# Altium schematic sheet Deneigus_Sensors.SchDoc
size Tabloid; Sheet_Name: Sensors; Size: 11x17
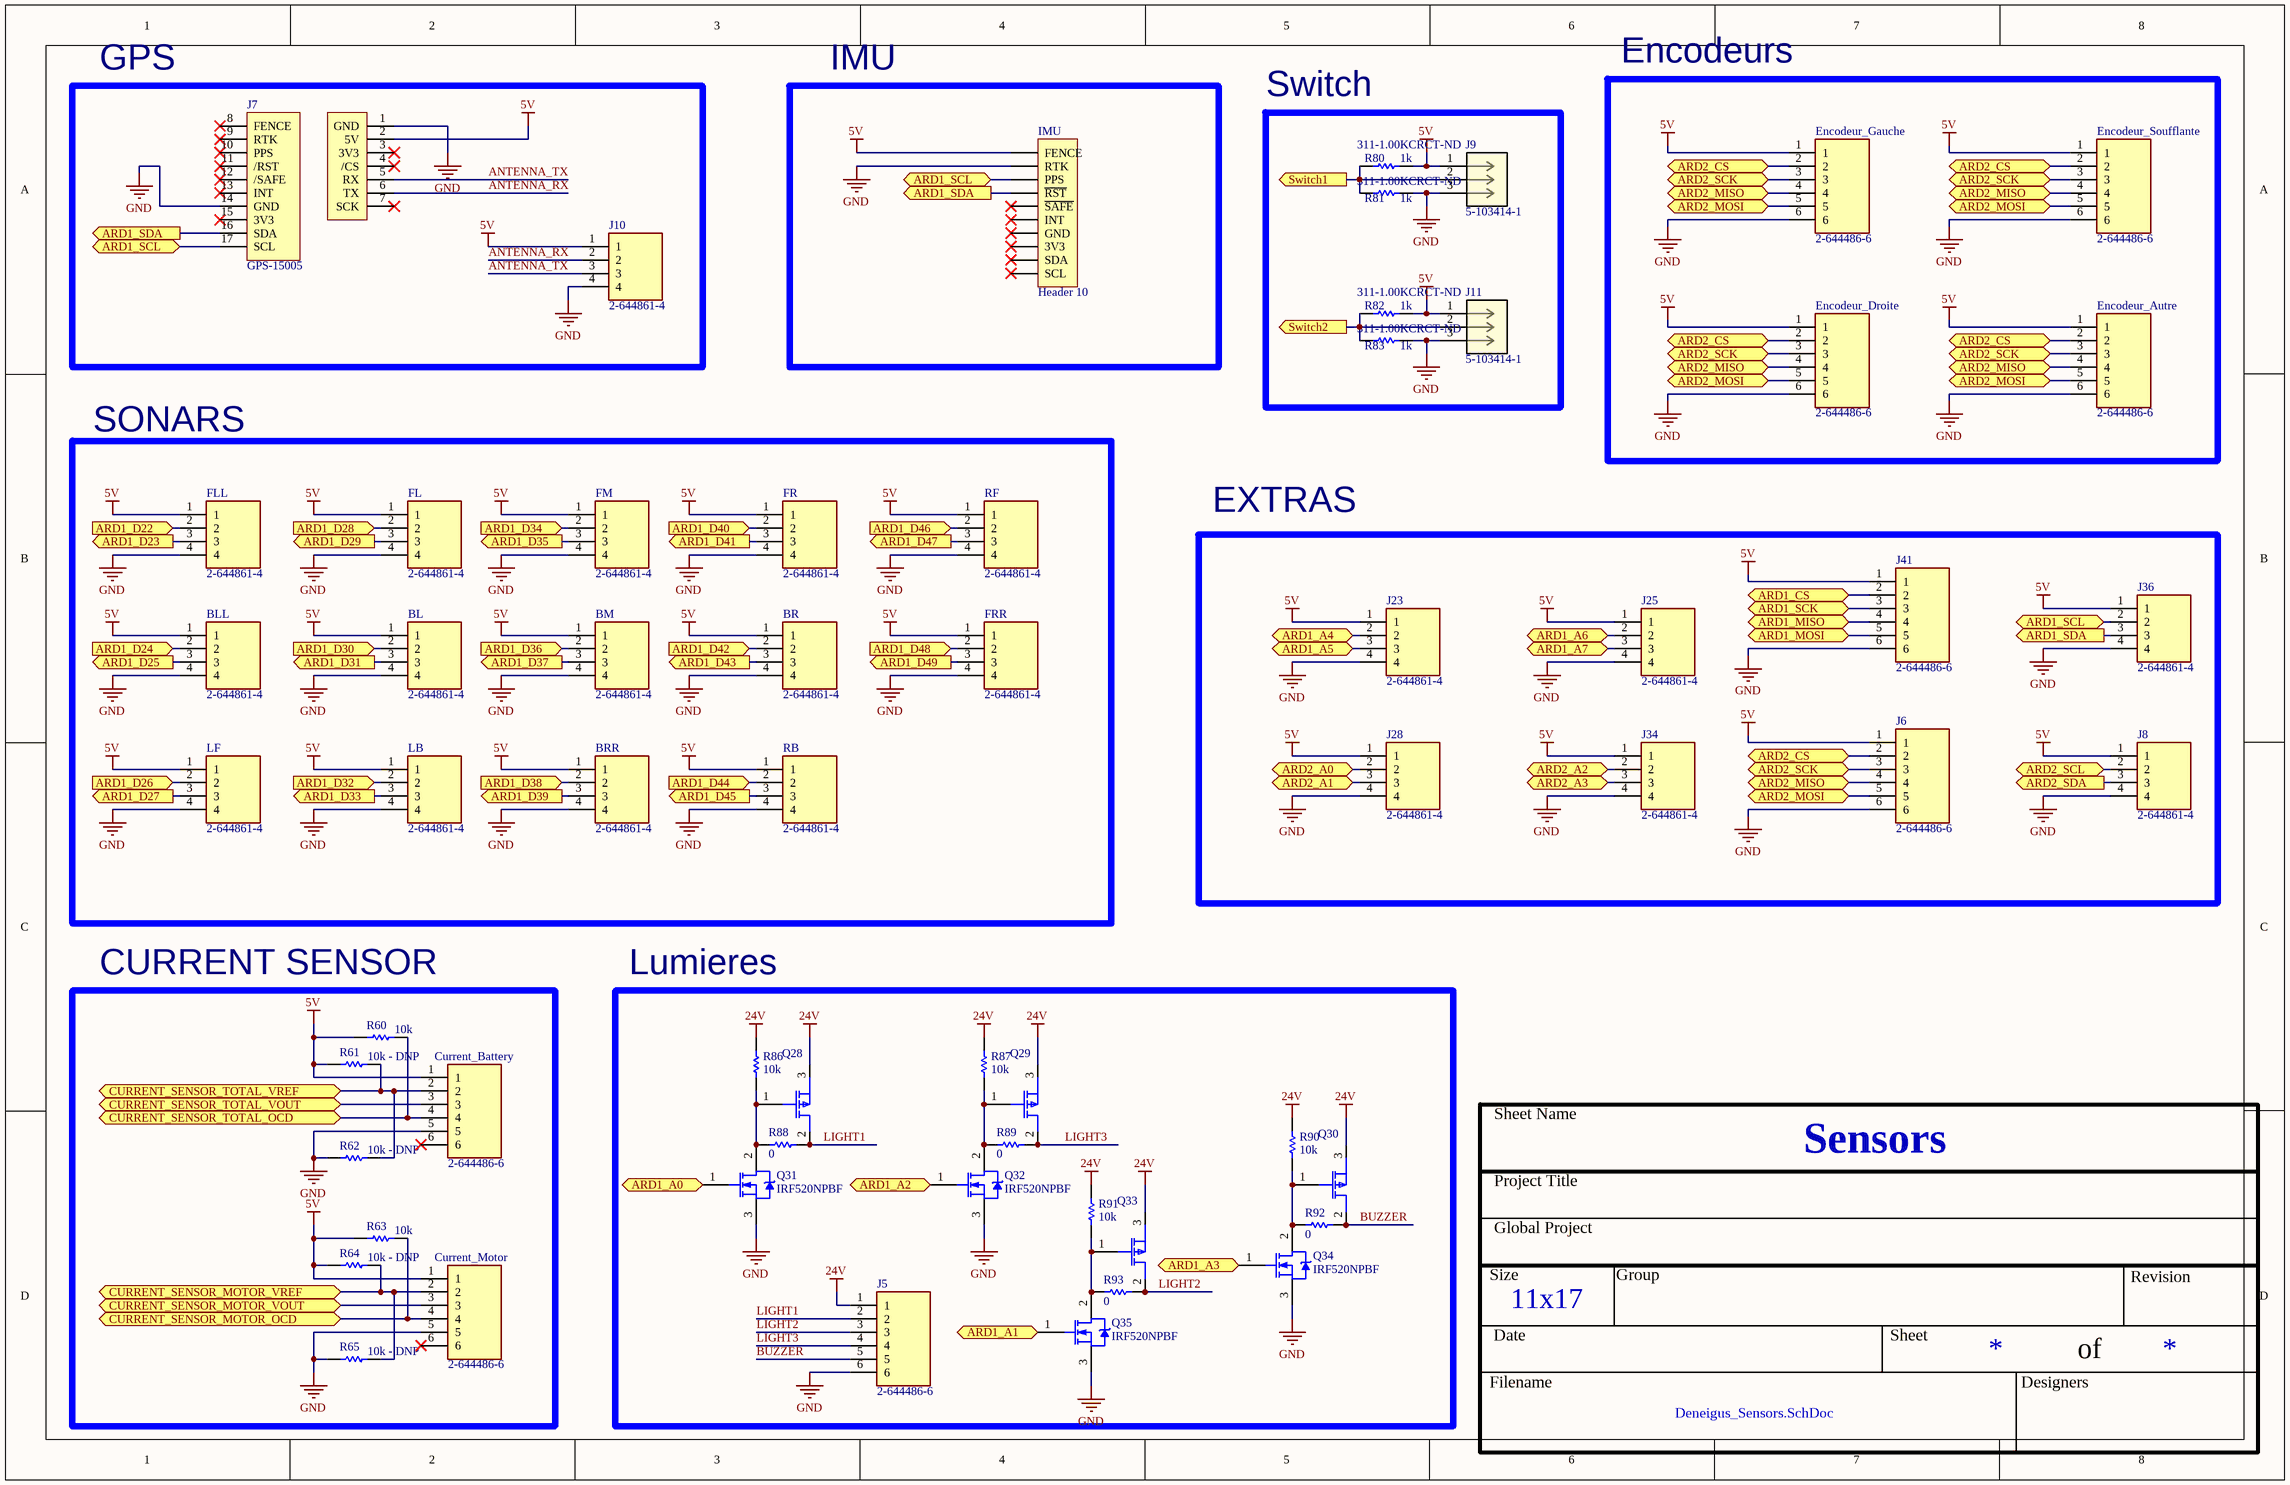
[diagram p0: Deneigus_Sensors.SchDoc]

## Parts
BL  2-644861-4  [TE_2-644861-4]
BLL  2-644861-4  [TE_2-644861-4]
BM  2-644861-4  [TE_2-644861-4]
BR  2-644861-4  [TE_2-644861-4]
BRR  2-644861-4  [TE_2-644861-4]
Current_Battery  2-644486-6  [TE_2-644486-6]
Current_Motor  2-644486-6  [TE_2-644486-6]
Encodeur_Autre  2-644486-6  [TE_2-644486-6]
Encodeur_Droite  2-644486-6  [TE_2-644486-6]
Encodeur_Gauche  2-644486-6  [TE_2-644486-6]
Encodeur_Soufflante  2-644486-6  [TE_2-644486-6]
FL  2-644861-4  [TE_2-644861-4]
FLL  2-644861-4  [TE_2-644861-4]
FM  2-644861-4  [TE_2-644861-4]
FR  2-644861-4  [TE_2-644861-4]
FRR  2-644861-4  [TE_2-644861-4]
IMU  Header 10  [HDR1X10]
J5  2-644486-6  [TE_2-644486-6]
J6  2-644486-6  [TE_2-644486-6]
J7  GPS-15005  [GPS_PFB]
J8  2-644861-4  [TE_2-644861-4]
J9  5-103414-1  [CONN_5-103414-1_TYCO]
J10  2-644861-4  [TE_2-644861-4]
J11  5-103414-1  [CONN_5-103414-1_TYCO]
J23  2-644861-4  [TE_2-644861-4]
J25  2-644861-4  [TE_2-644861-4]
J28  2-644861-4  [TE_2-644861-4]
J34  2-644861-4  [TE_2-644861-4]
J36  2-644861-4  [TE_2-644861-4]
J41  2-644486-6  [TE_2-644486-6]
LB  2-644861-4  [TE_2-644861-4]
LF  2-644861-4  [TE_2-644861-4]
Q28  MOSFET P-CH 55V 12A TO220AB  [IRF9Z24NPBF]  (value not drawn)
Q29  MOSFET P-CH 55V 12A TO220AB  [IRF9Z24NPBF]  (value not drawn)
Q30  MOSFET P-CH 55V 12A TO220AB  [IRF9Z24NPBF]  (value not drawn)
Q31  IRF520NPBF  [INTR-TO-220AB-3]
Q32  IRF520NPBF  [INTR-TO-220AB-3]
Q33  MOSFET P-CH 55V 12A TO220AB  [IRF9Z24NPBF]  (value not drawn)
Q34  IRF520NPBF  [INTR-TO-220AB-3]
Q35  IRF520NPBF  [INTR-TO-220AB-3]
R60  value 10k  [RES_0805]  (hidden comment: Res1)
R61  value 10k - DNP  [RES_0805]  (hidden comment: Res1)
R62  value 10k - DNP  [RES_0805]  (hidden comment: Res1)
R63  value 10k  [RES_0805]  (hidden comment: Res1)
R64  value 10k - DNP  [RES_0805]  (hidden comment: Res1)
R65  value 10k - DNP  [RES_0805]  (hidden comment: Res1)
R80  value 1k  Supplier Part Number 1: 311-1.00KCRCT-ND  [RES_0805]  (hidden comment: RES - 0805)
R81  value 1k  Supplier Part Number 1: 311-1.00KCRCT-ND  [RES_0805]  (hidden comment: RES - 0805)
R82  value 1k  Supplier Part Number 1: 311-1.00KCRCT-ND  [RES_0805]  (hidden comment: RES - 0805)
R83  value 1k  Supplier Part Number 1: 311-1.00KCRCT-ND  [RES_0805]  (hidden comment: RES - 0805)
R86  value 10k  [RES_0805]  (hidden comment: Res1)
R87  value 10k  [RES_0805]  (hidden comment: Res1)
R88  value 0  [RES_0805]  (hidden comment: Res1)
R89  value 0  [RES_0805]  (hidden comment: Res1)
R90  value 10k  [RES_0805]  (hidden comment: Res1)
R91  value 10k  [RES_0805]  (hidden comment: Res1)
R92  value 0  [RES_0805]  (hidden comment: Res1)
R93  value 0  [RES_0805]  (hidden comment: Res1)
RB  2-644861-4  [TE_2-644861-4]
RF  2-644861-4  [TE_2-644861-4]

## Blocks framed on the sheet
GPS: J7 J10
IMU: IMU
Switch: J9 J11 R80-R83
Encodeurs: Encodeur_Autre Encodeur_Droite Encodeur_Gauche Encodeur_Soufflante
SONARS: BL BLL BM BR BRR FL FLL FM FR FRR LB LF RB RF
EXTRAS: J6 J8 J23 J25 J28 J34 J36 J41
CURRENT SENSOR: Current_Battery Current_Motor R60-R65
Lumieres: J5 Q28-Q35 R86-R93

## Ports
ARD1_A0 (bidir), ARD1_A1 (bidir), ARD1_A2 (bidir), ARD1_A3 (bidir), ARD1_A4 (bidir), ARD1_A5 (bidir), ARD1_A6 (bidir), ARD1_A7 (bidir), ARD1_CS (bidir), ARD1_D22 (in), ARD1_D23 (out), ARD1_D24 (in), ARD1_D25 (out), ARD1_D26 (in), ARD1_D27 (out), ARD1_D28 (in), ARD1_D29 (out), ARD1_D30 (in), ARD1_D31 (out), ARD1_D32 (in), ARD1_D33 (out), ARD1_D34 (in), ARD1_D35 (out), ARD1_D36 (in), ARD1_D37 (out), ARD1_D38 (in), ARD1_D39 (out), ARD1_D40 (in), ARD1_D41 (out), ARD1_D42 (in), ARD1_D43 (out), ARD1_D44 (in), ARD1_D45 (out), ARD1_D46 (in), ARD1_D47 (out), ARD1_D48 (in), ARD1_D49 (out), ARD1_MISO (bidir), ARD1_MOSI (bidir), ARD1_SCK (bidir), ARD1_SCL (bidir), ARD1_SDA (out), ARD2_A0 (bidir), ARD2_A1 (bidir), ARD2_A2 (bidir), ARD2_A3 (bidir), ARD2_CS (bidir), ARD2_MISO (bidir), ARD2_MOSI (bidir), ARD2_SCK (bidir), ARD2_SCL (bidir), ARD2_SDA (out), CURRENT_SENSOR_MOTOR_OCD (bidir), CURRENT_SENSOR_MOTOR_VOUT (bidir), CURRENT_SENSOR_MOTOR_VREF (bidir), CURRENT_SENSOR_TOTAL_OCD (bidir), CURRENT_SENSOR_TOTAL_VOUT (bidir), CURRENT_SENSOR_TOTAL_VREF (bidir), Switch1 (out), Switch2 (out)

## Nets
5V: BL.1 BLL.1 BM.1 BR.1 BRR.1 Current_Battery.1 Current_Motor.1 Encodeur_Autre.1 Encodeur_Droite.1 Encodeur_Gauche.1 Encodeur_Soufflante.1 FL.1 FLL.1 FM.1 FR.1 FRR.1 IMU.1(FENCE) J6.1 J7.2(5V) J8.1 J9.1 J10.1 J11.1 J23.1 J25.1 J28.1 J34.1 J36.1 J41.1 LB.1 LF.1 R60.2 R61.2 R63.2 R64.2 R80.2 R82.2 RB.1 RF.1
24V: J5.1 Q28.3(Source) Q29.3(Source) Q30.3(Source) Q33.3(Source) R86.1 R87.1 R90.1 R91.1
GND: BL.4 BLL.4 BM.4 BR.4 BRR.4 Current_Battery.5 Current_Motor.5 Encodeur_Autre.6 Encodeur_Droite.6 Encodeur_Gauche.6 Encodeur_Soufflante.6 FL.4 FLL.4 FM.4 FR.4 FRR.4 IMU.2(RTK) J5.6 J6.6 J7.1(GND) J7.14(GND) J8.4 J9.3 J10.4 J11.3 J23.4 J25.4 J28.4 J34.4 J36.4 J41.6 LB.4 LF.4 Q31.3(S) Q32.3(S) Q34.3(S) Q35.3(S) R62.2 R65.2 R81.1 R83.1 RB.4 RF.4
ANTENNA_RX: J7.6(TX) J10.2
ANTENNA_TX: J7.5(RX) J10.3
ARD1_A0: Q31.1(G) ; port ARD1_A0
ARD1_A1: Q35.1(G) ; port ARD1_A1
ARD1_A2: Q32.1(G) ; port ARD1_A2
ARD1_A3: Q34.1(G) ; port ARD1_A3
ARD1_A4: J23.2 ; port ARD1_A4
ARD1_A5: J23.3 ; port ARD1_A5
ARD1_A6: J25.2 ; port ARD1_A6
ARD1_A7: J25.3 ; port ARD1_A7
ARD1_CS: J41.2 ; port ARD1_CS
ARD1_D22: FLL.2 ; port ARD1_D22
ARD1_D23: FLL.3 ; port ARD1_D23
ARD1_D24: BLL.2 ; port ARD1_D24
ARD1_D25: BLL.3 ; port ARD1_D25
ARD1_D26: LF.2 ; port ARD1_D26
ARD1_D27: LF.3 ; port ARD1_D27
ARD1_D28: FL.2 ; port ARD1_D28
ARD1_D29: FL.3 ; port ARD1_D29
ARD1_D30: BL.2 ; port ARD1_D30
ARD1_D31: BL.3 ; port ARD1_D31
ARD1_D32: LB.2 ; port ARD1_D32
ARD1_D33: LB.3 ; port ARD1_D33
ARD1_D34: FM.2 ; port ARD1_D34
ARD1_D35: FM.3 ; port ARD1_D35
ARD1_D36: BM.2 ; port ARD1_D36
ARD1_D37: BM.3 ; port ARD1_D37
ARD1_D38: BRR.2 ; port ARD1_D38
ARD1_D39: BRR.3 ; port ARD1_D39
ARD1_D40: FR.2 ; port ARD1_D40
ARD1_D41: FR.3 ; port ARD1_D41
ARD1_D42: BR.2 ; port ARD1_D42
ARD1_D43: BR.3 ; port ARD1_D43
ARD1_D44: RB.2 ; port ARD1_D44
ARD1_D45: RB.3 ; port ARD1_D45
ARD1_D46: RF.2 ; port ARD1_D46
ARD1_D47: RF.3 ; port ARD1_D47
ARD1_D48: FRR.2 ; port ARD1_D48
ARD1_D49: FRR.3 ; port ARD1_D49
ARD1_MISO: J41.4 ; port ARD1_MISO
ARD1_MOSI: J41.5 ; port ARD1_MOSI
ARD1_SCK: J41.3 ; port ARD1_SCK
ARD1_SCL: IMU.3(PPS) J7.17(SCL) J36.2 ; port ARD1_SCL
ARD1_SDA: IMU.4(~{RST}) J7.16(SDA) J36.3 ; port ARD1_SDA
ARD2_A0: J28.2 ; port ARD2_A0
ARD2_A1: J28.3 ; port ARD2_A1
ARD2_A2: J34.2 ; port ARD2_A2
ARD2_A3: J34.3 ; port ARD2_A3
ARD2_CS: Encodeur_Autre.2 Encodeur_Droite.2 Encodeur_Gauche.2 Encodeur_Soufflante.2 J6.2 ; port ARD2_CS
ARD2_MISO: Encodeur_Autre.4 Encodeur_Droite.4 Encodeur_Gauche.4 Encodeur_Soufflante.4 J6.4 ; port ARD2_MISO
ARD2_MOSI: Encodeur_Autre.5 Encodeur_Droite.5 Encodeur_Gauche.5 Encodeur_Soufflante.5 J6.5 ; port ARD2_MOSI
ARD2_SCK: Encodeur_Autre.3 Encodeur_Droite.3 Encodeur_Gauche.3 Encodeur_Soufflante.3 J6.3 ; port ARD2_SCK
ARD2_SCL: J8.2 ; port ARD2_SCL
ARD2_SDA: J8.3 ; port ARD2_SDA
BUZZER: J5.5 Q30.2(Drain) R92.2
CURRENT_SENSOR_MOTOR_OCD: Current_Motor.4 R63.1 ; port CURRENT_SENSOR_MOTOR_OCD
CURRENT_SENSOR_MOTOR_VOUT: Current_Motor.3 ; port CURRENT_SENSOR_MOTOR_VOUT
CURRENT_SENSOR_MOTOR_VREF: Current_Motor.2 R64.1 R65.1 ; port CURRENT_SENSOR_MOTOR_VREF
CURRENT_SENSOR_TOTAL_OCD: Current_Battery.4 R60.1 ; port CURRENT_SENSOR_TOTAL_OCD
CURRENT_SENSOR_TOTAL_VOUT: Current_Battery.3 ; port CURRENT_SENSOR_TOTAL_VOUT
CURRENT_SENSOR_TOTAL_VREF: Current_Battery.2 R61.1 R62.1 ; port CURRENT_SENSOR_TOTAL_VREF
LIGHT1: J5.2 Q28.2(Drain) R88.2
LIGHT2: J5.3 Q33.2(Drain) R93.2
LIGHT3: J5.4 Q29.2(Drain) R89.2
Switch1: J9.2 R80.1 R81.2 ; port Switch1
Switch2: J11.2 R82.1 R83.2 ; port Switch2
NetQ28_1: Q28.1(Gate) Q31.2(D) R86.2 R88.1
NetQ29_1: Q29.1(Gate) Q32.2(D) R87.2 R89.1
NetQ30_1: Q30.1(Gate) Q34.2(D) R90.2 R92.1
NetQ33_1: Q33.1(Gate) Q35.2(D) R91.2 R93.1

Not connected (* = marked no-connect by the designer): Current_Battery 6*; Current_Motor 6*; IMU 5(~{SAFE})* 6(INT)* 7(GND)* 8(3V3)* 9(SDA)* 10(SCL)*; J7 3(3V3)* 4(/CS)* 7(SCK)* 8(FENCE)* 9(RTK)* 10(PPS)* 11(/RST)* 12(/SAFE)* 13(INT)* 15(3V3)*

## Notes on the sheet
- Sheet Name
- Project Title
- Global Project
- Size
- Group
- Revision
- Date
- Sheet
- of
- Filename
- Designers

## Library data of the parts
BL BLL BM BR BRR FL FLL FM FR FRR J8 J10 J23 J25 J28 J34 J36 LB LF RB RF = 2-644861-4: Connector Header Through Hole 4 position 0.100 (2.54mm); MF: TE Connectivity; Availability: Good; Value: *; Check_prices: https://www.snapeda.com/parts/2-644861-4/TE%20Connectivity%20AMP%20Connectors/view-part/2876279/?ref=eda; Package: None; Price: None; MP: 2-644861-4; SnapEDA_Link: https://www.snapeda.com/parts/2-644861-4/TE%20Connectivity%20AMP%20Connectors/view-part/2876279/?ref=snap; Purchase-URL: https://pricing.snapeda.com/search/part/2-644861-4/?ref=eda
Current_Battery Current_Motor Encodeur_Autre Encodeur_Droite Encodeur_Gauche Encodeur_Soufflante J5 J6 J41 = 2-644486-6: 06P MTA100 SHRDED HDR ASSY SN; MF: TE Connectivity; DigiKey-Purchase-URL: https://snapeda.com/shop?store=DigiKey&id=2876038; Mouser-Purchase-URL: https://snapeda.com/shop?store=Mouser&id=2876038; SnapEDA_Link: https://www.snapeda.com/parts/2-644486-6/TE%20Connectivity%20AMP%20Connectors/view-part/2876038/?ref=snap; Digi-Key_Part_Number: A30896-ND; MP: 2-644486-6; Value: *; Package: None; Supplier 1: Digikey; Supplier Part Number 1: A30896-ND
IMU = Header 10: Header, 10-Pin; LatestRevisionDate: 17-Jul-2002; LatestRevisionNote: Re-released for DXP Platform.; Publisher: Altium Limited; Supplier 1: Digikey; Supplier Part Number 1: 732-2670-ND
J7 = GPS_PFB: Supplier 1: Digi-Key; Supplier Part Number 1: 1568-1970-ND
J9 J11 = 5-103414-1: No Description Available; Vendor: TE Connectivity; Built_By: EMA_UL_Team; SourceLibrary: Tyco_2012-1-03; Manufacturer_Part_Number: 5-103414-1; Copyright: Copyright (C) 2016 Accelerated Designs. All rights reserved; RefDes: RefDes; Type: DEV; Supplier 1: Digikey; Supplier Part Number 1: A32977-ND
Q28-Q30 Q33 = IRF9Z24NPBF: Supplier 1: Digikey; Supplier Part Number 1: IRF9Z24NPBF-ND
Q31 Q32 Q34 Q35 = CMP-013-00017-4: HEXFET(R) Power MOSFET, 100 V, 9.7 A, 0.2 Ohm, -55 to 175 degC, 3-Pin FM (TO-220AB), RoHS, Tube; Manufacturer: International Rectifier; Power: 48W; Elements: 1; Typical Rise Time: 23ns; Nominal Dual Supply Voltage: 100V; Rds On Max: 200mohm; Input Capacitance: 330pF; Nominal Vgs: 4V; Package Reference: TO-220AB; Max Operating Temperature: 175°C; Datasheet Version: Nov-03; Datasheet URL: http://www.infineon.com/dgdl/irf520npbf.pdf?fileId=5546d462533600a4015355e340711985; Package Quantity: 50; Package Description: 3-Pin Flange Mount, Body 4.445 x 10.415 mm, Pitch 2.54 mm; Pins: 3; Packaging: Rail/Tube; RoHS Compliant: True; Min Operating Temperature: -55°C; Case/Package: TO-220-3; Mounting Technology: TH
R60-R65 R86-R93 = Res1: Resistor; Published: 8-Jun-2000; LatestRevisionDate: 17-Jul-2002; LatestRevisionNote: Re-released for DXP Platform.; PackageReference: AXIAL-0.3; Publisher: Altium Limited; PackageDescription: Axial Device, Thru-Hole; 2 Leads; 0.3 in Pin Spacing
  R86-R93: Supplier 1: digikey; Supplier Part Number 1: RNCP0805FTD10K0CT-ND
R80-R83 = RES - 0805: Precision: 1%; Current: *; CreatedBy: Jonathan Bouchard; Package: 0805; Supplier 1: Digi-Key